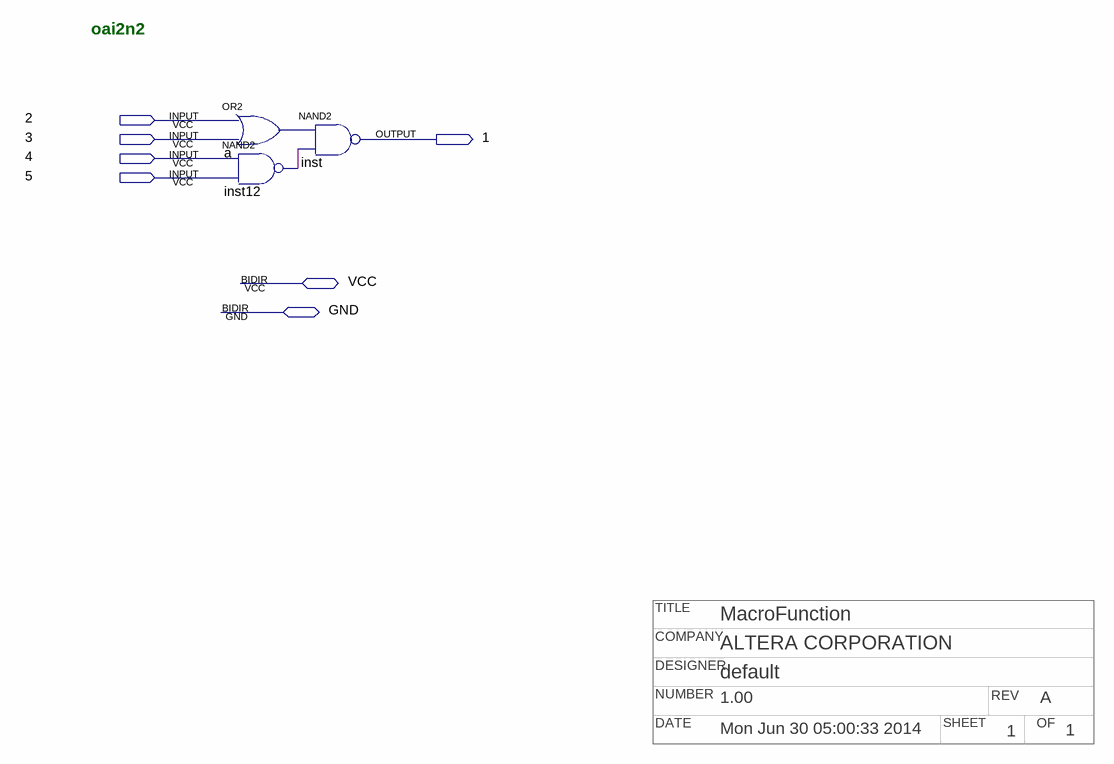
[diagram p0: schematic sheet]
// Quartus schematic npoai2n2.bdf as structural Verilog: 3 symbols, 7 pins
// Title block: TITLE: MacroFunction; COMPANY: ALTERA CORPORATION; DESIGNER: default; NUMBER: 1.00; REV: A; DATE: Mon Jun 30 05:00:33 2014; SHEET: 1; OF: 1
module npoai2n2 (
  input  \2 ,
  input  \3 ,
  input  \4 ,
  input  \5 ,
  inout  VCC,
  inout  GND,
  output \1 
);

  wire a_out, inst12_out;

  or a (a_out, \2 , \3 );
  nand inst12 (inst12_out, \4 , \5 );
  nand inst (\1 , a_out, inst12_out);

  // Notes on the sheet:
  //   oai2n2
endmodule
